# Altium schematic sheet RC_Car.SchDoc: RC_Car
size A4; ApprovedBy: Maduranga Mathara Arachchi; CheckedBy: Maduranga Mathara Arachchi; Author: Maduranga Mathara Arachchi; CompanyName: Maduranga Mathara Arachchi; DrawnBy: Maduranga Mathara Arachchi; Engineer: Maduranga Mathara Arachchi; Organization: Maduranga Mathara Arachchi; Address1: 17/21, Gnanawimala Road,; Address2: Athurugiriya; Address3: Colombo,; Address4: Sri Lanka.; DocumentNumber: 1; Revision: 0.1; SheetNumber: 3; SheetTotal: 7
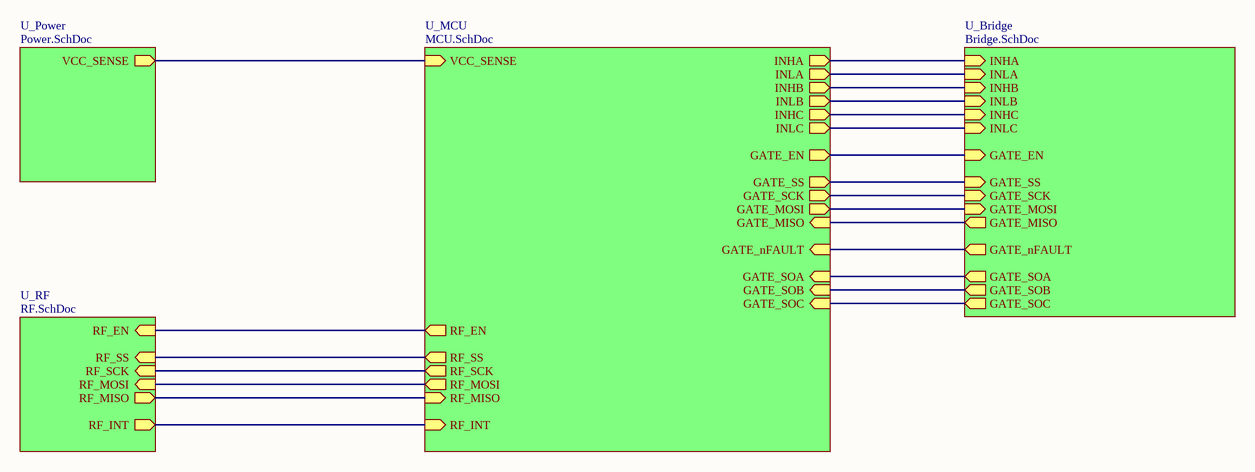
[diagram p0: RC_Car.SchDoc]

## Sub-sheets
U_Bridge = Bridge.SchDoc: GATE_SOA (out), GATE_SOB (out), GATE_SOC (out), GATE_SCK (in), GATE_MOSI (in), GATE_SS (in), GATE_EN (in), INHA (in), INHB (in), INHC (in), INLA (in), INLC (in), INLB (in), GATE_nFAULT (out), GATE_MISO (out)
U_MCU = MCU.SchDoc: VCC_SENSE (in), GATE_SOA (in), GATE_SOB (in), GATE_SOC (in), GATE_SCK (out), GATE_MOSI (out), GATE_SS (out), GATE_EN (out), INHA (out), INHB (out), INHC (out), INLA (out), INLC (out), INLB (out), GATE_nFAULT (in), GATE_MISO (in), RF_EN (out), RF_MOSI (out), RF_SCK (out), RF_SS (out), RF_MISO (in), RF_INT (in)
U_Power = Power.SchDoc: VCC_SENSE (out)
U_RF = RF.SchDoc: RF_EN (in), RF_MOSI (in), RF_SCK (in), RF_SS (in), RF_MISO (out), RF_INT (out)

## Nets
(unnamed): sheet U_MCU/VCC_SENSE, sheet U_Power/VCC_SENSE
(unnamed): sheet U_MCU/GATE_SOA, sheet U_Bridge/GATE_SOA
(unnamed): sheet U_MCU/GATE_SOB, sheet U_Bridge/GATE_SOB
(unnamed): sheet U_MCU/GATE_SOC, sheet U_Bridge/GATE_SOC
(unnamed): sheet U_MCU/GATE_SCK, sheet U_Bridge/GATE_SCK
(unnamed): sheet U_MCU/GATE_MOSI, sheet U_Bridge/GATE_MOSI
(unnamed): sheet U_MCU/GATE_SS, sheet U_Bridge/GATE_SS
(unnamed): sheet U_MCU/GATE_EN, sheet U_Bridge/GATE_EN
(unnamed): sheet U_MCU/INHA, sheet U_Bridge/INHA
(unnamed): sheet U_MCU/INHB, sheet U_Bridge/INHB
(unnamed): sheet U_MCU/INHC, sheet U_Bridge/INHC
(unnamed): sheet U_MCU/INLA, sheet U_Bridge/INLA
(unnamed): sheet U_MCU/INLC, sheet U_Bridge/INLC
(unnamed): sheet U_MCU/INLB, sheet U_Bridge/INLB
(unnamed): sheet U_MCU/GATE_nFAULT, sheet U_Bridge/GATE_nFAULT
(unnamed): sheet U_MCU/GATE_MISO, sheet U_Bridge/GATE_MISO
(unnamed): sheet U_MCU/RF_EN, sheet U_RF/RF_EN
(unnamed): sheet U_MCU/RF_MOSI, sheet U_RF/RF_MOSI
(unnamed): sheet U_MCU/RF_SCK, sheet U_RF/RF_SCK
(unnamed): sheet U_MCU/RF_SS, sheet U_RF/RF_SS
(unnamed): sheet U_MCU/RF_MISO, sheet U_RF/RF_MISO
(unnamed): sheet U_MCU/RF_INT, sheet U_RF/RF_INT

## Notes on the sheet
- Title
- Size:
- Date:
- A4
- Number:
- Time:
- Revision:
- Sheet
- of
- File: